# EAGLE design ESP-WRITE (EAGLE 6.6.0)
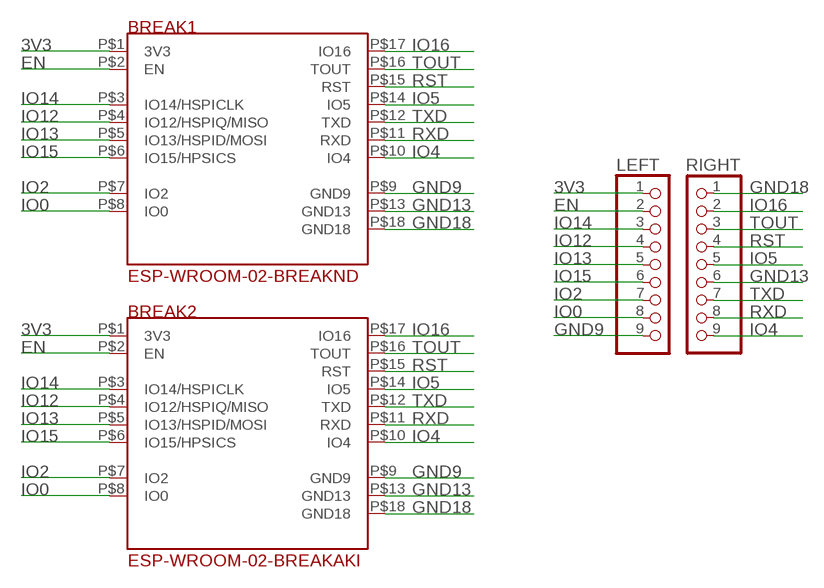
[diagram p0: schematic, sheet 1]

## Parts
BREAK1  ESP-WROOM-02-BREAKND  [ESP-WROOM-02-BREAK-NODETAIL]
BREAK2  ESP-WROOM-02-BREAKAKI  [ESP-WROOM-02-AKI]
LEFT  PINHD-1X9  [1X09]
RIGHT  PINHD-1X9  [1X09]

## Nets
3V3: BREAK1.P$1(3V3) BREAK2.P$1(3V3) LEFT.1
EN: BREAK1.P$2(EN) BREAK2.P$2(EN) LEFT.2
GND9: BREAK1.P$9(GND9) BREAK2.P$9(GND9) LEFT.9
GND13: BREAK1.P$13(GND13) BREAK2.P$13(GND13) RIGHT.6
GND18: BREAK1.P$18(GND18) BREAK2.P$18(GND18) RIGHT.1
IO0: BREAK1.P$8(IO0) BREAK2.P$8(IO0) LEFT.8
IO2: BREAK1.P$7(IO2) BREAK2.P$7(IO2) LEFT.7
IO4: BREAK1.P$10(IO4) BREAK2.P$10(IO4) RIGHT.9
IO5: BREAK1.P$14(IO5) BREAK2.P$14(IO5) RIGHT.5
IO12: BREAK1.P$4(IO12/HSPIQ/MISO) BREAK2.P$4(IO12/HSPIQ/MISO) LEFT.4
IO13: BREAK1.P$5(IO13/HSPID/MOSI) BREAK2.P$5(IO13/HSPID/MOSI) LEFT.5
IO14: BREAK1.P$3(IO14/HSPICLK) BREAK2.P$3(IO14/HSPICLK) LEFT.3
IO15: BREAK1.P$6(IO15/HPSICS) BREAK2.P$6(IO15/HPSICS) LEFT.6
IO16: BREAK1.P$17(IO16) BREAK2.P$17(IO16) RIGHT.2
RST: BREAK1.P$15(RST) BREAK2.P$15(RST) RIGHT.4
RXD: BREAK1.P$11(RXD) BREAK2.P$11(RXD) RIGHT.8
TOUT: BREAK1.P$16(TOUT) BREAK2.P$16(TOUT) RIGHT.3
TXD: BREAK1.P$12(TXD) BREAK2.P$12(TXD) RIGHT.7

## Library data of the parts
BREAK1 BREAK2 = PCR-Module:ESP-WROOM-02-BREAK
LEFT RIGHT = pinhead:PINHD-1X9: PIN HEADER

## Board
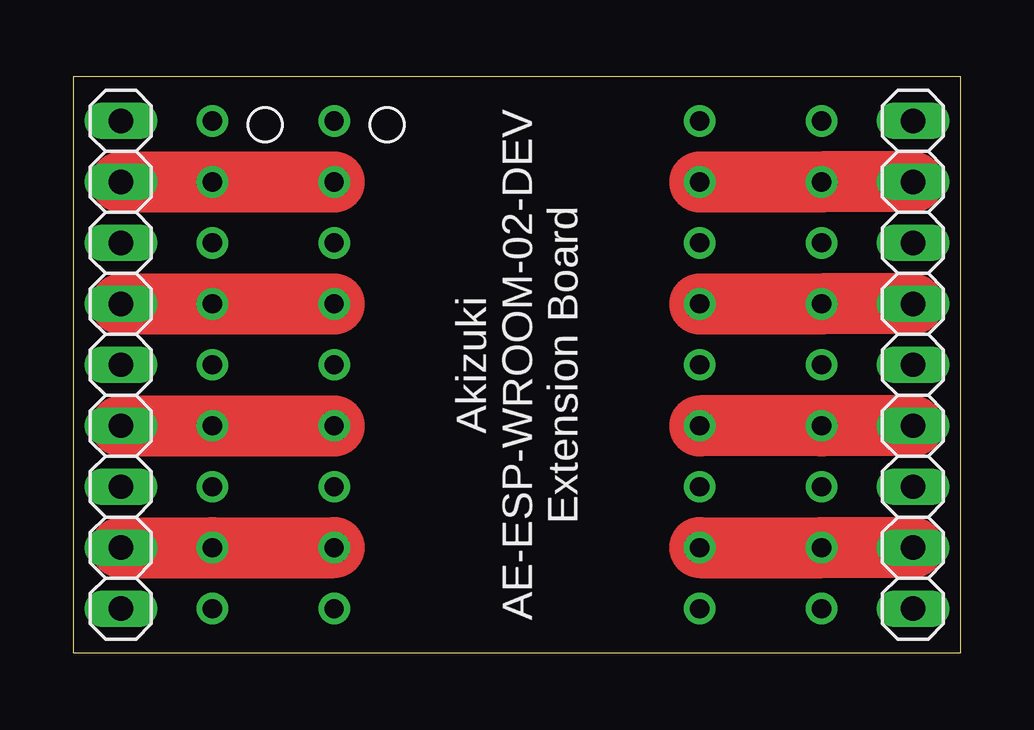
[diagram p1: board, top side]
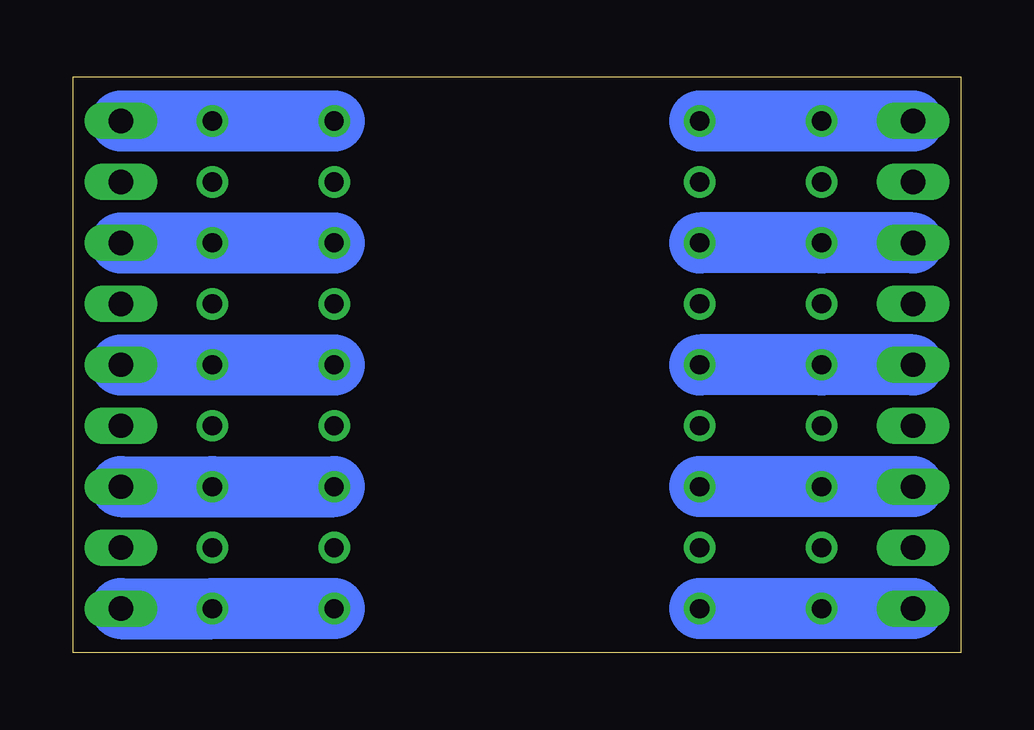
[diagram p2: board, bottom side, seen from below]

Size 37 x 24 mm. Coordinates in mm from the lower left corner, seen from the top.
Outline: 0,0 37,0 37,24 0,24 0,0
Copper layers (1*16): Top 0.035mm / dielectric 1.5mm / Bottom 0.035mm
Design rules "SeeedStudio_2layer_DRU_no_angle_20140221": minimum track width 6mil, minimum drill 12mil, track to track 6mil, track to pad 6mil, pad to pad 6mil, via to via 6mil, smd to smd 0mil, copper to edge 10mil, drill to drill 10mil, minimum pad ring 10mil, minimum via ring 6mil, stop-mask expansion 2mil, vias tented up to drill 100mil, thermal gap 10mil

### Footprints (pad centres in the part's own frame; a part is rotated, then mirrored left to right if it is on the bottom)
ESP-WROOM-02-BREAK-NODETAIL = drill 0.8: P$1 -12.7,10.16; P$2 -12.7,7.62; P$3 -12.7,5.08; P$4 -12.7,2.54; P$5 -12.7,0; P$6 -12.7,-2.54; P$7 -12.7,-5.08; P$8 -12.7,-7.62; P$9 -12.7,-10.16; P$10 12.7,-10.16; P$11 12.7,-7.62; P$12 12.7,-5.08; P$13 12.7,-2.54; P$14 12.7,0; P$15 12.7,2.54; P$16 12.7,5.08; P$17 12.7,7.62; P$18 12.7,10.16
ESP-WROOM-02-AKI = drill 0.8: P$1 -7.62,10.16; P$2 -7.62,7.62; P$3 -7.62,5.08; P$4 -7.62,2.54; P$5 -7.62,0; P$6 -7.62,-2.54; P$7 -7.62,-5.08; P$8 -7.62,-7.62; P$9 -7.62,-10.16; P$10 7.62,-10.16; P$11 7.62,-7.62; P$12 7.62,-5.08; P$13 7.62,-2.54; P$14 7.62,0; P$15 7.62,2.54; P$16 7.62,5.08; P$17 7.62,7.62; P$18 7.62,10.16
1X09 = drill 1.016 long: 1 -10.16,0; 2 -7.62,0; 3 -5.08,0; 4 -2.54,0; 5 0,0; 6 2.54,0; 7 5.08,0; 8 7.62,0; 9 10.16,0

### Placement (x,y rotation side)
BREAK1  18.5,12 0 top
BREAK2  18.5,12 0 top
LEFT  1.99,12 270 top
RIGHT  35.01,12 270 top

### Tracks (layer width: path | path; a pad name or v marks a point on that pad's centre or on a via)
3V3
  Bottom 2.54: BREAK2.P$1 BREAK1.P$1 LEFT.1
EN
  Top 2.54: LEFT.2 BREAK1.P$2 BREAK2.P$2
GND9
  Bottom 2.54: LEFT.9 BREAK1.P$9 BREAK2.P$9
GND13
  Top 2.54: RIGHT.6 BREAK1.P$13 BREAK2.P$13
GND18
  Bottom 2.54: RIGHT.1 BREAK1.P$18 BREAK2.P$18
IO0
  Top 2.54: LEFT.8 BREAK1.P$8 BREAK2.P$8
IO2
  Bottom 2.54: LEFT.7 BREAK1.P$7 BREAK2.P$7
IO4
  Bottom 2.54: BREAK2.P$10 BREAK1.P$10 RIGHT.9
IO5
  Bottom 2.54: RIGHT.5 BREAK1.P$14 BREAK2.P$14
IO12
  Top 2.54: LEFT.4 BREAK1.P$4 BREAK2.P$4
IO13
  Bottom 2.54: LEFT.5 BREAK1.P$5 BREAK2.P$5
IO14
  Bottom 2.54: LEFT.3 BREAK1.P$3 BREAK2.P$3
IO15
  Top 2.54: LEFT.6 BREAK1.P$6 BREAK2.P$6
IO16
  Top 2.54: BREAK2.P$17 BREAK1.P$17 RIGHT.2
RST
  Top 2.54: BREAK2.P$15 BREAK1.P$15 RIGHT.4
RXD
  Top 2.54: BREAK2.P$11 BREAK1.P$11 RIGHT.8
TOUT
  Bottom 2.54: RIGHT.3 BREAK1.P$16 BREAK2.P$16
TXD
  Bottom 2.54: RIGHT.7 BREAK1.P$12 BREAK2.P$12

### Text on the board
tPlace: Akizuki / AE-ESP-WROOM-02-DEV / Extension Board